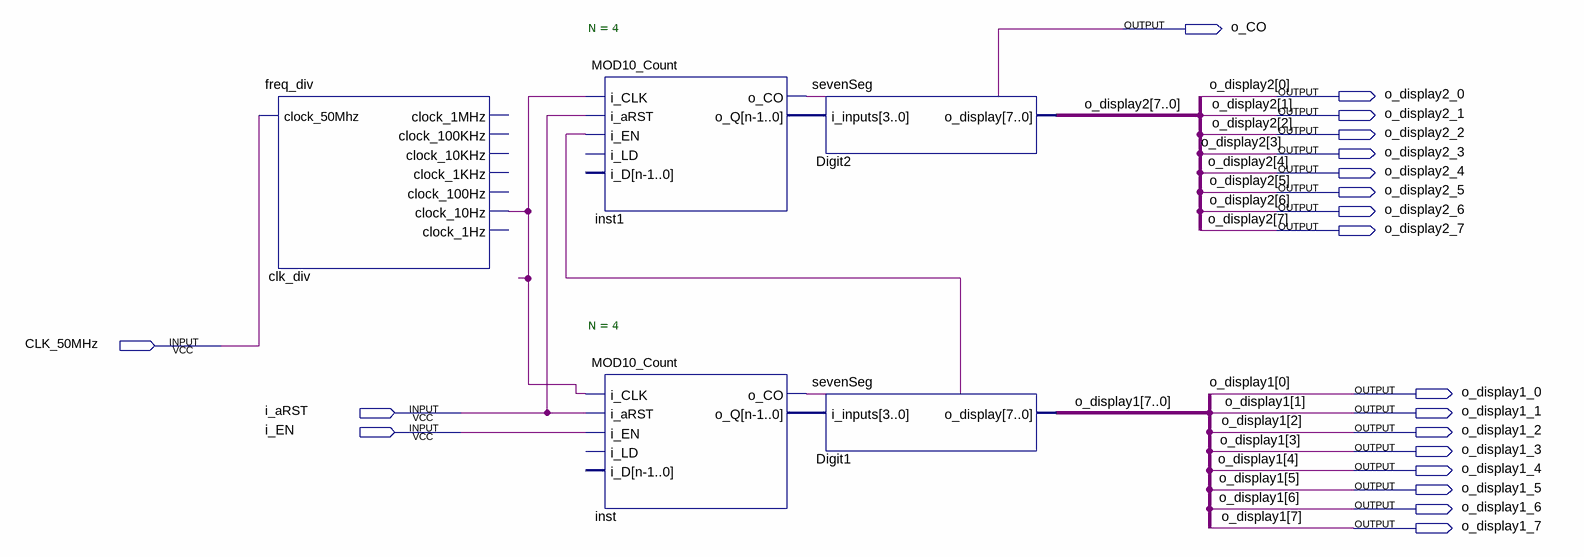
[diagram p0: schematic sheet]
// Quartus schematic Dual_MOD10_counter.bdf as structural Verilog: 5 symbols, 20 pins
module Dual_MOD10_counter (
  input  CLK_50MHz,
  input  i_aRST,
  input  i_EN,
  output o_CO,
  output o_display2_0,
  output o_display2_1,
  output o_display2_2,
  output o_display2_3,
  output o_display2_4,
  output o_display2_5,
  output o_display2_6,
  output o_display2_7,
  output o_display1_0,
  output o_display1_1,
  output o_display1_2,
  output o_display1_3,
  output o_display1_4,
  output o_display1_5,
  output o_display1_6,
  output o_display1_7
);

  wire clk_div_clock_10hz, inst_o_co;
  wire [3:0] inst1_o_q, inst_o_q;

  freq_div clk_div (
    .clock_50Mhz(CLK_50MHz), .clock_10Hz(clk_div_clock_10hz));  // open: clock_1MHz, clock_100KHz, clock_10KHz, clock_1KHz, clock_100Hz, clock_1Hz
  MOD10_Count #(.N(4)) inst1 (
    .i_CLK(clk_div_clock_10hz), .i_aRST(i_aRST), .i_EN(inst_o_co), .o_CO(o_CO), .o_Q(inst1_o_q));  // open: i_LD, i_D
  MOD10_Count #(.N(4)) inst (
    .i_CLK(clk_div_clock_10hz), .i_aRST(i_aRST), .i_EN(i_EN), .o_CO(inst_o_co), .o_Q(inst_o_q));  // open: i_LD, i_D
  sevenSeg Digit2 (
    .i_inputs(inst1_o_q),
    .o_display({o_display2_7, o_display2_6, o_display2_5, o_display2_4, o_display2_3, o_display2_2, o_display2_1, o_display2_0}));
  sevenSeg Digit1 (
    .i_inputs(inst_o_q),
    .o_display({o_display1_7, o_display1_6, o_display1_5, o_display1_4, o_display1_3, o_display1_2, o_display1_1, o_display1_0}));

  // Other names for the same wires on the sheet: o_display1[7:0] = {o_display1_7, o_display1_6, o_display1_5, o_display1_4, o_display1_3, o_display1_2, o_display1_1, o_display1_0};
  //   o_display2[7:0] = {o_display2_7, o_display2_6, o_display2_5, o_display2_4, o_display2_3, o_display2_2, o_display2_1, o_display2_0}
endmodule
